# Altium schematic sheet Sheet1.SchDoc
size A4
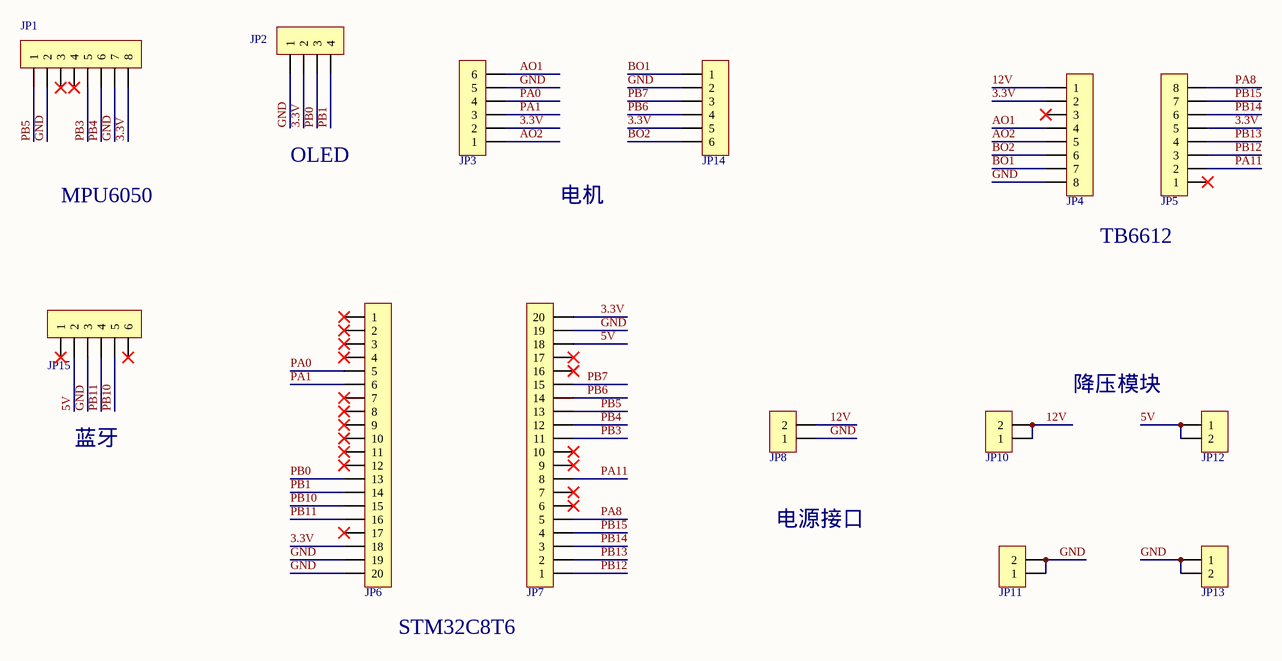
[diagram p0: Sheet1.SchDoc]

## Parts
JP1  HDR-1X8  [HDR2.54-M-LI-8P]  (value not drawn)
JP2  HDR-1X4  [HDR2.54-M-LI-4P]  (value not drawn)
JP3  HDR-1X6  [HDR2.54-LI-6P]  (value not drawn)
JP4  HDR-1X8  [HDR2.54-M-LI-8P]  (value not drawn)
JP5  HDR-1X8  [HDR2.54-M-LI-8P]  (value not drawn)
JP6  HDR-1X20  [HDR2.54-M-LI-20P]  (value not drawn)
JP7  HDR-1X20  [HDR2.54-M-LI-20P]  (value not drawn)
JP8  HDR-1X2  [HDR2.54-M-LI-2P]  (value not drawn)
JP10  HDR-1X2  [HDR2.54-M-LI-2P]  (value not drawn)
JP11  HDR-1X2  [HDR2.54-M-LI-2P]  (value not drawn)
JP12  HDR-1X2  [HDR2.54-M-LI-2P]  (value not drawn)
JP13  HDR-1X2  [HDR2.54-M-LI-2P]  (value not drawn)
JP14  HDR-1X6  [HDR2.54-LI-6P]  (value not drawn)
JP15  HDR-1X6  [HDR2.54-LI-6P]  (value not drawn)

## Nets
3.3V: JP1.8 JP2.2 JP3.2 JP4.2 JP5.5 JP6.18 JP7.20 JP14.5
5V: JP7.18 JP12.1 JP12.2 JP15.2
12V: JP4.1 JP8.2 JP10.1 JP10.2
AO1: JP3.6 JP4.4
AO2: JP3.1 JP4.5
BO1: JP4.7 JP14.1
BO2: JP4.6 JP14.6
GND: JP1.2 JP1.7 JP2.1 JP3.5 JP4.8 JP6.19 JP6.20 JP7.19 JP8.1 JP11.1 JP11.2 JP13.1 JP13.2 JP14.2 JP15.3
PA0: JP3.4 JP6.5
PA1: JP3.3 JP6.6
PA8: JP5.8 JP7.5
PA11: JP5.2 JP7.8
PB0: JP2.3 JP6.13
PB1: JP2.4 JP6.14
PB3: JP1.5 JP7.11
PB4: JP1.6 JP7.12
PB5: JP1.1 JP7.13
PB6: JP7.14 JP14.4
PB7: JP7.15 JP14.3
PB10: JP6.15 JP15.5
PB11: JP6.16 JP15.4
PB12: JP5.3 JP7.1
PB13: JP5.4 JP7.2
PB14: JP5.6 JP7.3
PB15: JP5.7 JP7.4

Not connected (* = marked no-connect by the designer): JP1 3* 4*; JP4 3*; JP5 1*; JP6 1* 2* 3* 4* 7* 8* 9* 10* 11* 12* 17*; JP7 6* 7* 9* 10* 16* 17*; JP15 1* 6*

## Notes on the sheet
- MPU6050
- OLED
- 电机
- TB6612
- 降压模块
- 蓝牙
- 电源接口
- STM32C8T6

## Library data of the parts
JP1 JP4 JP5 = Header 8: 8P接插件; 版权归属: 封装库来自淘宝 ID：黄晶宝石; BOM名称: 8P接插件; 学习资源: https://shop463601444.taobao.com
JP2 = Header 4: 4P接插件; 版权归属: 封装库来自淘宝 ID：黄晶宝石; BOM名称: 4P接插件; 学习资源: https://shop463601444.taobao.com
JP3 JP14 JP15 = Header 6: 6P接插件; 版权归属: 封装库来自淘宝 ID：黄晶宝石; BOM名称: 6P接插件; 学习资源: https://shop463601444.taobao.com
JP6 JP7 = Header 20: 20P接插件; 版权归属: 封装库来自淘宝 ID：黄晶宝石; BOM名称: 20P接插件; 学习资源: https://shop463601444.taobao.com
JP8 JP10-JP13 = Header 2: 2P接插件; 版权归属: 封装库来自淘宝 ID：黄晶宝石; BOM名称: 2P接插件; 联系售后: https://shop463601444.taobao.com